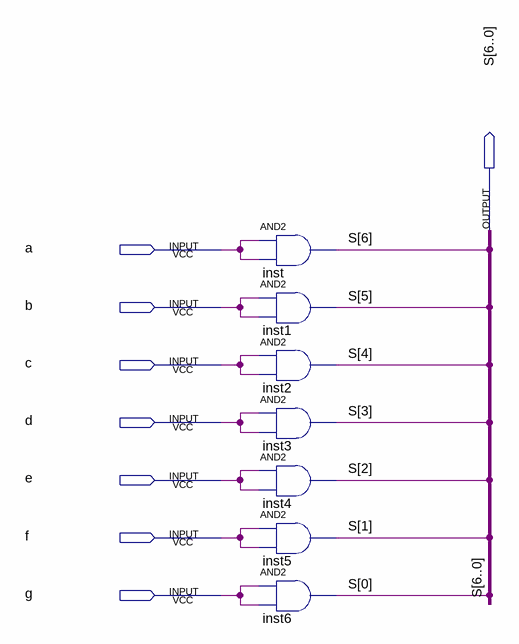
[diagram p0: schematic sheet]
// Quartus schematic Led.bdf as structural Verilog: 7 symbols, 8 pins
module Led (
  input  a,
  input  b,
  input  c,
  input  d,
  input  e,
  input  f,
  input  g,
  output [6:0] S
);

  and inst (S[6], a, a);
  and inst1 (S[5], b, b);
  and inst2 (S[4], c, c);
  and inst3 (S[3], d, d);
  and inst4 (S[2], e, e);
  and inst5 (S[1], f, f);
  and inst6 (S[0], g, g);
endmodule
